# Altium project EASY-EAI-Nano-TB V1.01.PrjPcb (part 4 of 4)

## Sheet 18.ADB.SchDoc
size A4; CheckedBy: YPC; DocumentNumber: 18; Revision: V1.00; SheetNumber: 18; SheetTotal: 18; SheetName: ADB; SheetDescribe: SheetDescribe; Designer: JOW; DesignDate: 2025-04-25; CheckedData: 2025-04-25; Rule: PcbType=ProtelPcb
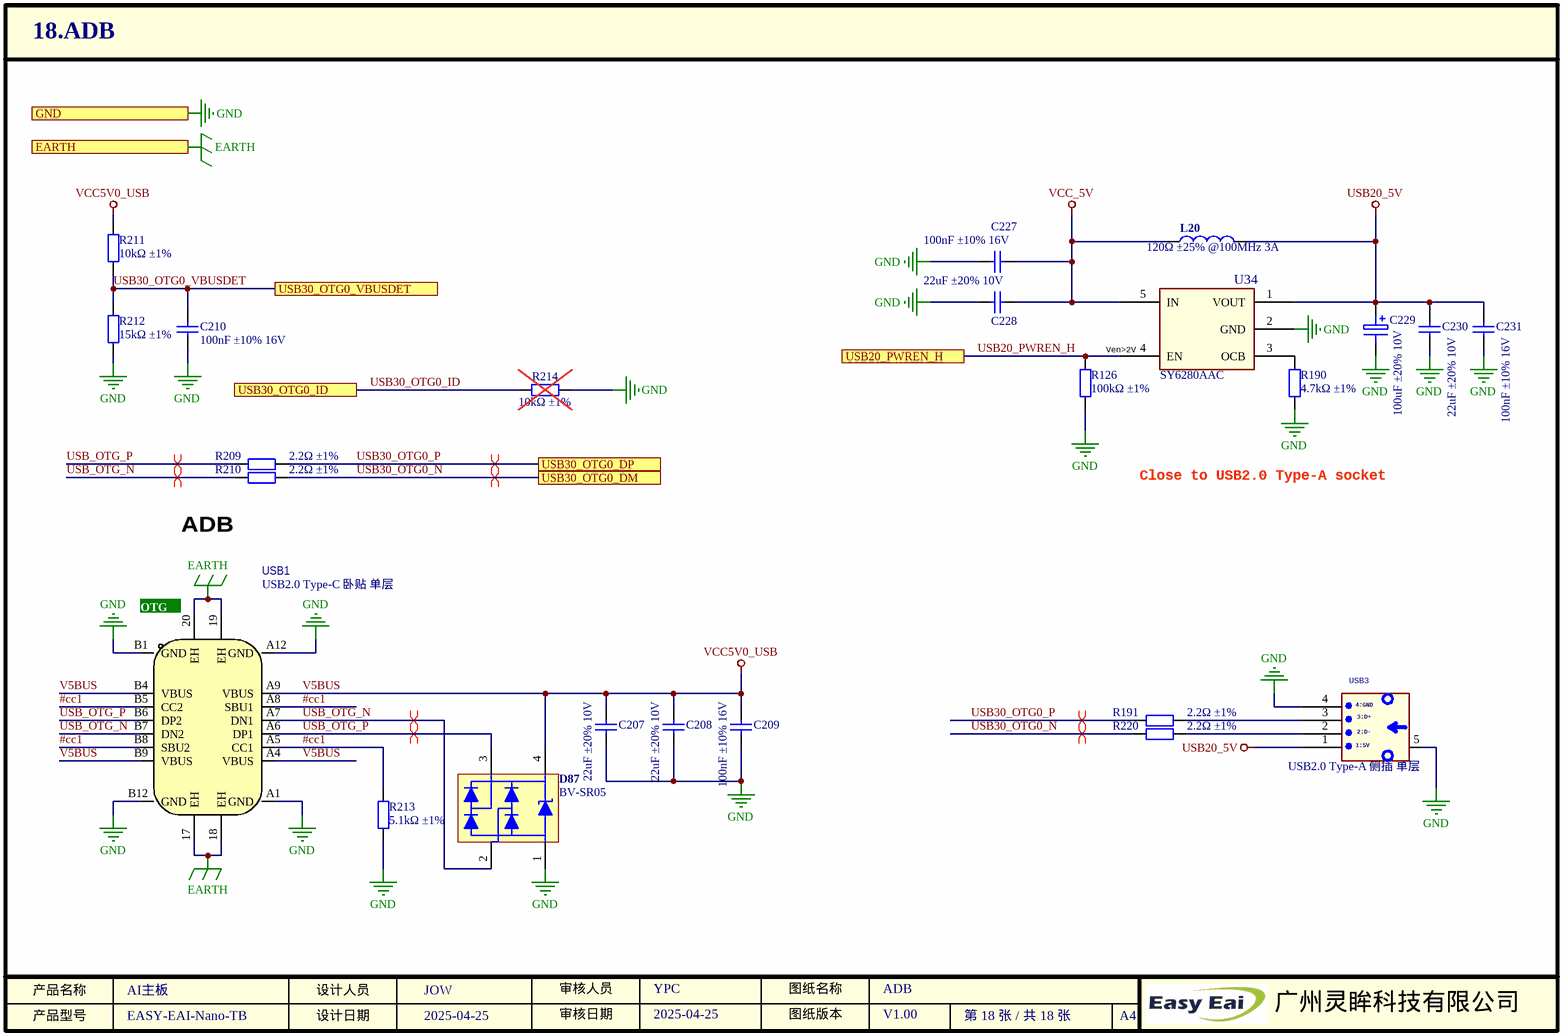
[diagram p16: 18.ADB.SchDoc]

### Parts
C207  描述: 22uF ±20% 10V  [0603_C]  (hidden comment: CL10A226MP8NUNE)
C208  描述: 22uF ±20% 10V  [0603_C]  (hidden comment: CL10A226MP8NUNE)
C209  描述: 100nF ±10% 16V  [0402_C]  (hidden comment: CL05B104KO5NNNC)
C210  描述: 100nF ±10% 16V  [0402_C]  (hidden comment: CL05B104KO5NNNC)
C227  描述: 100nF ±10% 16V  [0402_C]  (hidden comment: CL05B104KO5NNNC)
C228  描述: 22uF ±20% 10V  [0603_C]  (hidden comment: CL10A226MP8NUNE)
C229  描述: 100uF ±20% 10V  [SMD,D5xL5.4mm]  (hidden comment: RVT1A101M0505)
C230  描述: 22uF ±20% 10V  [0603_C]  (hidden comment: CL10A226MP8NUNE)
C231  描述: 100nF ±10% 16V  [0402_C]  (hidden comment: CL05B104KO5NNNC)
D87  BV-SR05  [SOT-143]
L20  BLM18KG121TN1D  [0603_R]  (value not drawn)  (no BOM)
R126  描述: 100kΩ ±1%  [0402_R]  (hidden comment: 0402WGF1003TCE)
R190  描述: 4.7kΩ ±1%  [0402_R]  (hidden comment: 0402WGF4701TCE)
R191  描述: 2.2Ω ±1%  [0402_R]  (hidden comment: 0402WGF220KTCE)
R209  描述: 2.2Ω ±1%  [0402_R]  (hidden comment: 0402WGF220KTCE)
R210  描述: 2.2Ω ±1%  [0402_R]  (hidden comment: 0402WGF220KTCE)
R211  描述: 10kΩ ±1%  [0402_R]  (hidden comment: 0402WGF1002TCE)
R212  描述: 15kΩ ±1%  [0402_R]  (hidden comment: 0402WGF1502TCE)
R213  描述: 5.1kΩ ±1%  [0402_R]  (hidden comment: 0402WGF5101TCE)
R214  描述: 10kΩ ±1%  [0402_R]  (hidden comment: NC/0402WGF1002TCE)  (no BOM)
R220  描述: 2.2Ω ±1%  [0402_R]  (hidden comment: 0402WGF220KTCE)
U34  SY6280AAC  [SOT-23-5]
USB1  USB2.0 Type-C 卧贴 单层  [USB-TYPE-C_16PIN-MALE-TYPE-C-31-M-12]
USB3  U221-041N-1BU07-S1  [MINI-USB-SMD_U221-041N-1BU07-S1]  (value not drawn)

### Ports
EARTH, GND, USB20_PWREN_H, USB30_OTG0_DM, USB30_OTG0_DP, USB30_OTG0_ID, USB30_OTG0_VBUSDET

### Nets
EARTH: USB1.17(EH) USB1.18(EH) USB1.19(EH) USB1.20(EH) ; port EARTH
GND: C207.1 C208.1 C209.1 C210.1 C227.1 C228.2 C229.2 C230.1 C231.1 D87.1 R126.1 R190.1 R212.1 R213.1 R214.1 U34.2(GND) USB1.A1(GND) USB1.A12(GND) USB1.B1(GND) USB1.B12(GND) USB3.4 USB3.5 ; port GND  [project net CHIP_GND]
USB20_5V: C229.1 C230.2 C231.2 L20.2 U34.1(VOUT) USB3.1
V5BUS: C207.2 C208.2 C209.2 D87.4 R211.2 USB1.A4(VBUS) USB1.A9(VBUS) USB1.B4(VBUS) USB1.B9(VBUS)  [also labelled VCC5V0_USB]
VCC_5V: C227.2 C228.1 L20.1 U34.5(IN)
#cc1: R213.2 USB1.A5(CC1) USB1.A8(SBU1) USB1.B5(CC2) USB1.B8(SBU2)
USB20_PWREN_H: R126.2 U34.4(EN) ; port USB20_PWREN_H
USB30_OTG0_ID: R214.2 ; port USB30_OTG0_ID
USB30_OTG0_N: R210.2 R220.1 ; port USB30_OTG0_DM
USB30_OTG0_P: R191.1 R209.2 ; port USB30_OTG0_DP
USB30_OTG0_VBUSDET: C210.2 R211.1 R212.2 ; port USB30_OTG0_VBUSDET
USB_OTG_N: D87.2 R210.1 USB1.A7(DN1) USB1.B7(DN2)
USB_OTG_P: D87.3 R209.1 USB1.A6(DP1) USB1.B6(DP2)
NetR190_2: R190.2 U34.3(OCB)
NetR191_2: R191.2 USB3.3
NetR220_2: R220.2 USB3.2

### Layout directives
differential pair: USB30_OTG0_N, USB30_OTG0_P, USB_OTG_N, USB_OTG_P

### Notes on the sheet
- Ven>2V
- Close to USB2.0 Type-A socket
- ADB
- (near USB1) OTG
- 产品名称
- 产品型号
- 设计人员
- 设计日期
- 审核人员
- 审核日期
- 图纸版本
- 图纸名称
- A4
- 广州灵眸科技有限公司
- (in symbol USB2.0 Type-A 侧插 单层) 4:GND; 3:D+; 2:D-; 1:5V

### Library data of the parts
C207 C208 C228 C230 = 0603 22uF ±20% 10V: SPZL000315; 名称: 贴片电容; 厂商: SAMSUNG(三星); 封装: 0603; 工作温度: -55~85℃; 贴片和直插: SMD; 型号: CL10A226MP8NUNE; SuppliersPartNumber: C86295; 商品编号: SPZL000315
C209 C210 C227 C231 = 0402 100nF ±10% 16V: as C193-C198 on sheet 08.USB3.0-RGMII; 型号: CL05B104KO5NNNC; SuppliersPartNumber: C1525; 商品编号: SPZL000259
C229 = 电解电容 100uF ±20% 10V: SPZL000265; 名称: 电解电容; 厂商: ROQANG(容强); 贴片和直插: SMD; 工作温度: -55~105℃; SuppliersPartNumber: C72473; 封装: SMD,D5xL5.4mm; 型号: RVT1A101M0505; 商品编号: SPZL000265
D87 = TVS BV-SR05: SPZL000616; 名称: TVS; 厂商: Bencent(槟城); 贴片和直插: SMD; 描述: Vdrm=5V Cj=0.85pF; 工作温度: -40~125℃; 封装: SOT-143; SuppliersPartNumber: C413946; 商品编号: SPZL000616; 型号: BV-SR05
L20 = 120Ω ±25% @100MHz 3A: SPZL000842; 名称: 磁珠; 封装: 0603; 厂商: muRata(村田); 贴片和直插: SMD; 工作温度: -40~85℃; SuppliersPartNumber: C85831; 型号: BLM18KG121TN1D; 商品编号: SPZL000842; 描述: 120Ω ±25% @100MHz 3A
R126 = 0402 100kΩ ±1%: SPZL000282; 封装: 0402; 厂商: UNI-ROYAL(厚声); 贴片和直插: SMD; 名称: 电阻; 工作温度: -55~155℃; SuppliersPartNumber: C25741; 型号: 0402WGF1003TCE; 商品编号: SPZL000282
R190 = 0402 4.7kΩ ±1%: SPZL000280; 封装: 0402; 厂商: UNI-ROYAL(厚声); 贴片和直插: SMD; 名称: 电阻; 工作温度: -55~155℃; SuppliersPartNumber: C25900; 型号: 0402WGF4701TCE; 商品编号: SPZL000280
R191 R209 R210 R220 = 0402 2.2Ω ±1%: SPZL000327; 封装: 0402; 厂商: UNI-ROYAL(厚声); 贴片和直插: SMD; 名称: 电阻; 工作温度: -55~155℃; SuppliersPartNumber: C25101; 型号: 0402WGF220KTCE; 商品编号: SPZL000327
R211 R214 = 0402 10kΩ ±1%: SPZL000271; 封装: 0402; 厂商: UNI-ROYAL(厚声); 贴片和直插: SMD; 名称: 电阻; 工作温度: -55~155℃; SuppliersPartNumber: C25744; 型号: 0402WGF1002TCE; 商品编号: SPZL000271
R212 = 0402 15kΩ ±1%: SPZL000330; 封装: 0402; 厂商: UNI-ROYAL(厚声); 贴片和直插: SMD; 名称: 电阻; 工作温度: -55~155℃; SuppliersPartNumber: C25756; 型号: 0402WGF1502TCE; 商品编号: SPZL000330
R213 = 0402 5.1kΩ ±1%: SPZL000270; 封装: 0402; 厂商: UNI-ROYAL(厚声); 贴片和直插: SMD; 名称: 电阻; 工作温度: -55~155℃; SuppliersPartNumber: C25905; 型号: 0402WGF5101TCE; 商品编号: SPZL000270
U34 = SY6280AAC: SPZL000043; 贴片和直插: SMD; 厂商: silergy(矽力杰); 名称: 电源IC; 描述: 功率电子开关; 工作温度: -40~85℃; SuppliersPartNumber: C55136; 封装: SOT-23-5; 商品编号: SPZL000043; 型号: SY6280AAC
USB1 = USB2.0 Type-C 卧贴 单层: SPZL000132; 厂商: 韩国韩荣; 名称: USB连接器; 封装: SMD; 型号: TYPE-C-31-M-12; 贴片和直插: SMD; 商品编号: SPZL000132; SuppliersPartNumber: C165948; 描述: USB2.0 Type-C 卧贴 单层
USB3 = USB2.0 Type-A 侧插 单层: SPZL001070; 厂商: XKB Connection(中国星坤); 封装: 插件; 名称: USB连接器; 贴片和直插: THT; 工作温度: -45~85℃; 型号: U221-041N-1BU07-S1; 商品编号: SPZL001070; SuppliersPartNumber: C2682184; 描述: USB2.0 Type-A 侧插 单层

## Sheet 12.MiniPcie-4G.SchDoc
size A4; CheckedBy: YPC; DocumentNumber: 12; Revision: V1.00; SheetNumber: 12; SheetTotal: 18; SheetName: MiniPcie-4G; SheetDescribe: MiniPcie-4G/USB2.0; Designer: JOW; DesignDate: 2025-04-25; CheckedData: 2025-04-25; Rule: PcbType=ProtelPcb
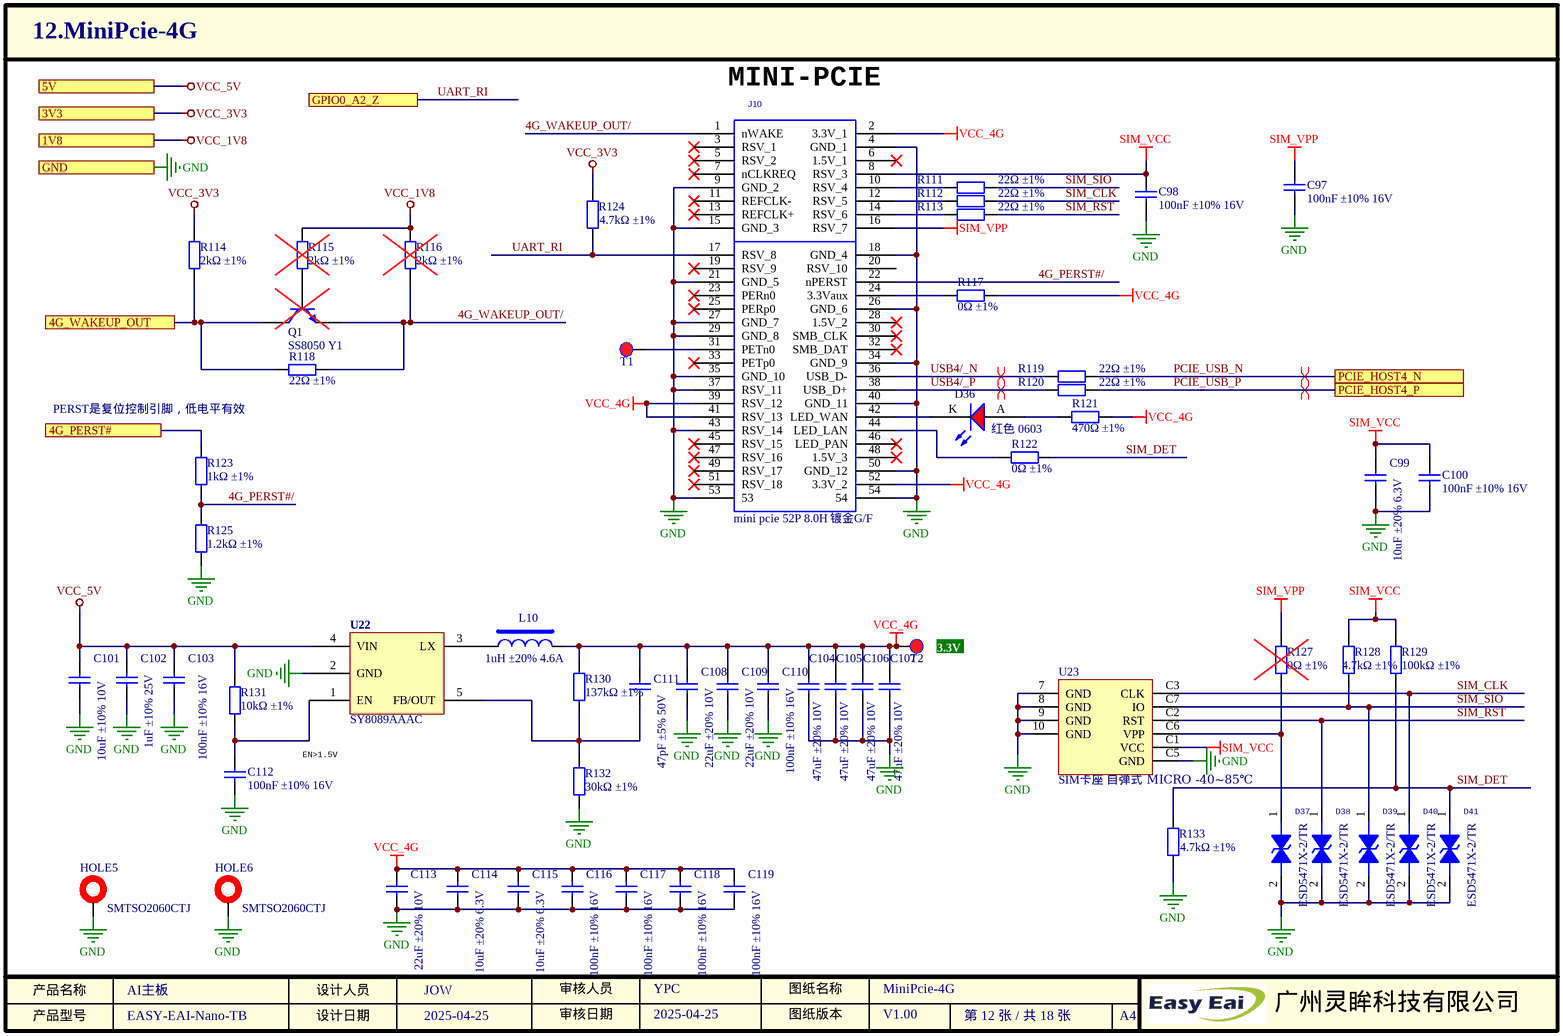
[diagram p17: 12.MiniPcie-4G.SchDoc]

### Parts
C97  描述: 100nF ±10% 16V  [0402_C]  (hidden comment: CL05B104KO5NNNC)
C98  描述: 100nF ±10% 16V  [0402_C]  (hidden comment: CL05B104KO5NNNC)
C99  描述: 10uF ±20% 6.3V  [0402_C]  (hidden comment: CL05A106MQ5NUNC)
C100  描述: 100nF ±10% 16V  [0402_C]  (hidden comment: CL05B104KO5NNNC)
C101  描述: 10uF ±10% 10V  [0603_C]  (hidden comment: CL10A106KP8NNNC)
C102  描述: 1uF ±10% 25V  [0402_C]  (hidden comment: CL05A105KA5NQNC)
C103  描述: 100nF ±10% 16V  [0402_C]  (hidden comment: CL05B104KO5NNNC)
C104  描述: 47uF ±20% 10V  [0805_C]  (hidden comment: C2012X5R1A476MTJ00E)
C105  描述: 47uF ±20% 10V  [0805_C]  (hidden comment: C2012X5R1A476MTJ00E)
C106  描述: 47uF ±20% 10V  [0805_C]  (hidden comment: C2012X5R1A476MTJ00E)
C107  描述: 47uF ±20% 10V  [0805_C]  (hidden comment: C2012X5R1A476MTJ00E)
C108  描述: 22uF ±20% 10V  [0603_C]  (hidden comment: CL10A226MP8NUNE)
C109  描述: 22uF ±20% 10V  [0603_C]  (hidden comment: CL10A226MP8NUNE)
C110  描述: 100nF ±10% 16V  [0402_C]  (hidden comment: CL05B104KO5NNNC)
C111  描述: 47pF ±5% 50V  [0402_C]  (hidden comment: NC/0402CG470J500NT)
C112  描述: 100nF ±10% 16V  [0402_C]  (hidden comment: CL05B104KO5NNNC)
C113  描述: 22uF ±20% 10V  [0603_C]  (hidden comment: CL10A226MP8NUNE)
C114  描述: 10uF ±20% 6.3V  [0402_C]  (hidden comment: CL05A106MQ5NUNC)
C115  描述: 10uF ±20% 6.3V  [0402_C]  (hidden comment: CL05A106MQ5NUNC)
C116  描述: 100nF ±10% 16V  [0402_C]  (hidden comment: CL05B104KO5NNNC)
C117  描述: 100nF ±10% 16V  [0402_C]  (hidden comment: CL05B104KO5NNNC)
C118  描述: 100nF ±10% 16V  [0402_C]  (hidden comment: CL05B104KO5NNNC)
C119  描述: 100nF ±10% 16V  [0402_C]  (hidden comment: CL05B104KO5NNNC)
D36  红色 0603  [0603_LED_S1]
D37  ESD5471X-2/TR  [FBP-02C]
D38  ESD5471X-2/TR  [FBP-02C]
D39  ESD5471X-2/TR  [FBP-02C]
D40  ESD5471X-2/TR  [FBP-02C]
D41  ESD5471X-2/TR  [FBP-02C]
HOLE5  SMTSO2060CTJ  [Mou Hole-373D600H-SMD]
HOLE6  SMTSO2060CTJ  [Mou Hole-373D600H-SMD]
J10  91304-80-052R2  [MEDC52-32F-PCIE-LOCK-L]  (value not drawn)
L10  WPN252010U1R0MT  [1008]  (value not drawn)
Q1  型号: SS8050 Y1  [SOT-23(SOT-23-3)]  (hidden comment: NC/SS8050 Y1)  (no BOM)
R111  描述: 22Ω ±1%  [0402_R]  (hidden comment: 0402WGF220JTCE)
R112  描述: 22Ω ±1%  [0402_R]  (hidden comment: 0402WGF220JTCE)
R113  描述: 22Ω ±1%  [0402_R]  (hidden comment: 0402WGF220JTCE)
R114  描述: 2kΩ ±1%  [0402_R]  (hidden comment: 0402WGF2001TCE)
R115  描述: 2kΩ ±1%  [0402_R]  (hidden comment: NC/0402WGF2001TCE)  (no BOM)
R116  描述: 2kΩ ±1%  [0402_R]  (hidden comment: NC/0402WGF2001TCE)  (no BOM)
R117  描述: 0Ω ±1%  [0402_R]  (hidden comment: 0402WGF0000TCE)
R118  描述: 22Ω ±1%  [0402_R]  (hidden comment: 0402WGF220JTCE)
R119  描述: 22Ω ±1%  [0402_R]  (hidden comment: 0402WGF220JTCE)
R120  描述: 22Ω ±1%  [0402_R]  (hidden comment: 0402WGF220JTCE)
R121  描述: 470Ω ±1%  [0402_R]  (hidden comment: AC0402FR-07470RL)
R122  描述: 0Ω ±1%  [0402_R]  (hidden comment: 0402WGF0000TCE)
R123  描述: 1kΩ ±1%  [0402_R]  (hidden comment: 0402WGF1001TCE)
R124  描述: 4.7kΩ ±1%  [0402_R]  (hidden comment: 0402WGF4701TCE)
R125  描述: 1.2kΩ ±1%  [0402_R]  (hidden comment: AC0402FR-071K2L)
R127  描述: 0Ω ±1%  [0402_R]  (hidden comment: NC/0402WGF0000TCE)  (no BOM)
R128  描述: 4.7kΩ ±1%  [0402_R]  (hidden comment: 0402WGF4701TCE)
R129  描述: 100kΩ ±1%  [0402_R]  (hidden comment: 0402WGF1003TCE)
R130  描述: 137kΩ ±1%  [0402_R]  (hidden comment: 0402WGF1373TCE)
R131  描述: 10kΩ ±1%  [0402_R]  (hidden comment: 0402WGF1002TCE)
R132  描述: 30kΩ ±1%  [0402_R]  (hidden comment: NQ02WGF3002TCE)
R133  描述: 4.7kΩ ±1%  [0402_R]  (hidden comment: 0402WGF4701TCE)
T1  TEST-DOT  [PAD-25/40]  (value not drawn)
T2  TEST-DOT  [PAD-25/40]  (value not drawn)
U22  SY8089AAAC  [SOT-23-5]
U23  描述: SIM卡座 自弹式 MICRO -40~85℃  [SIM-SMD_SMC-202-6]  (hidden comment: SMC-202-6)

### Ports
1V8, 3V3, 4G_PERST#, 4G_WAKEUP_OUT, 5V, GND, GPIO0_A2_Z, PCIE_HOST4_N, PCIE_HOST4_P

### Nets
GND: C97.1 C98.1 C99.1 C100.1 C101.1 C102.1 C103.1 C104.1 C105.1 C106.1 C107.1 C108.1 C109.1 C110.1 C112.1 C113.1 C114.1 C115.1 C116.1 C117.1 C118.1 C119.1 D37.2 D38.2 D39.2 D40.2 D41.2 HOLE5.1 HOLE6.1 J10.4(GND_1) J10.9(GND_2) J10.15(GND_3) J10.18(GND_4) J10.21(GND_5) J10.26(GND_6) J10.27(GND_7) J10.29(GND_8) J10.34(GND_9) J10.35(GND_10) J10.37(RSV_11) J10.40(GND_11) J10.43(RSV_14) J10.50(GND_12) J10.53 J10.54 R125.1 R132.1 R133.1 U22.2(GND) U23.7(GND) U23.8(GND) U23.9(GND) U23.10(GND) U23.C5(GND) ; port GND  [project net CHIP_GND]
SIM_VCC: C98.2 C99.2 C100.2 J10.8(RSV_3) R128.2 R129.2 U23.C1(VCC)
SIM_VPP: C97.2 J10.16(RSV_7) R127.2
VCC_1V8: R115.2 R116.2 ; port 1V8
VCC_3V3: R114.2 R124.2 ; port 3V3  [project net VCC3V3]
VCC_4G: C104.2 C105.2 C106.2 C107.2 C108.2 C109.2 C110.2 C111.2 C113.2 C114.2 C115.2 C116.2 C117.2 C118.2 C119.2 J10.2(3.3V_1) J10.39(RSV_12) J10.41(RSV_13) J10.52(3.3V_2) L10.2 R117.2 R121.2 R130.2 T2.1
VCC_5V: C101.2 C102.2 C103.2 R131.2 U22.4(VIN) ; port 5V
4G_PERST#/: J10.22(nPERST) R123.1 R125.2
4G_WAKEUP_OUT/: J10.1(nWAKE) Q1.2(E) R116.1 R118.2
PCIE_USB_N: R119.2 ; port PCIE_HOST4_N
PCIE_USB_P: R120.2 ; port PCIE_HOST4_P
SIM_CLK: D40.1 R112.2 U23.C3(CLK)
SIM_DET: D41.1 R122.2 R129.1 R133.2
SIM_RST: D38.1 R113.2 U23.C2(RST)
SIM_SIO: D39.1 R111.2 R128.1 U23.C7(IO)
UART_RI: J10.17(RSV_8) R124.1 ; port GPIO0_A2_Z
USB4/_N: J10.36(USB_D-) R119.1
USB4/_P: J10.38(USB_D+) R120.1
NetC111_1: C111.1 R130.1 R132.2 U22.5(FB/OUT)
NetC112_2: C112.2 R131.1 U22.1(EN)
NetD36_A: D36.A R121.1
NetD36_K: D36.K J10.42(LED_WAN)
NetD37_1: D37.1 R127.1 U23.C6(VPP)
NetJ10_10: J10.10(RSV_4) R111.1
NetJ10_12: J10.12(RSV_5) R112.1
NetJ10_14: J10.14(RSV_6) R113.1
NetJ10_24: J10.24(3.3Vaux) R117.1
NetJ10_31: J10.31(PETn0) T1.1
NetJ10_44: J10.44(LED_LAN) R122.1
NetL10_1: L10.1 U22.3(LX)
NetQ1_1: Q1.1(B) R115.1
NetQ1_3: Q1.3(C) R114.1 R118.1 ; port 4G_WAKEUP_OUT
NetR123_2: R123.2 ; port 4G_PERST#

Not connected (* = marked no-connect by the designer): J10 3(RSV_1)* 5(RSV_2)* 6(1.5V_1)* 7(nCLKREQ)* 11(REFCLK-)* 13(REFCLK+)* 19(RSV_9)* 20(RSV_10) 23(PERn0)* 25(PERp0)* 28(1.5V_2)* 30(SMB_CLK)* 32(SMB_DAT)* 33(PETp0)* 45(RSV_15)* 46(LED_PAN)* 47(RSV_16)* 48(1.5V_3)* 49(RSV_17)* 51(RSV_18)*

### Layout directives
differential pair: PCIE_USB_N, PCIE_USB_P, USB4/_N, USB4/_P

### Notes on the sheet
- (near J10) MINI-PCIE
- PERST是复位控制引脚，低电平有效
- (near T2) 3.3V
- EN>1.5V
- 产品名称
- 产品型号
- 设计人员
- 设计日期
- 审核人员
- 审核日期
- 图纸版本
- 图纸名称
- A4
- 广州灵眸科技有限公司

### Library data of the parts
C97 C98 C100 C103 C110 C112 C116-C119 = 0402 100nF ±10% 16V: as C193-C198 on sheet 08.USB3.0-RGMII; 型号: CL05B104KO5NNNC; SuppliersPartNumber: C1525; 商品编号: SPZL000259
C99 C114 C115 = 0402 10uF ±20% 6.3V: SPZL000269; 名称: 贴片电容; 厂商: SAMSUNG(三星); 封装: 0402; 工作温度: -55~85℃; 贴片和直插: SMD; 型号: CL05A106MQ5NUNC; SuppliersPartNumber: C15525; 商品编号: SPZL000269
C101 = 0603 10uF ±10% 10V: SPZL000260; 名称: 贴片电容; 厂商: SAMSUNG(三星); 封装: 0603; 工作温度: -55~85℃; 贴片和直插: SMD; 型号: CL10A106KP8NNNC; SuppliersPartNumber: C19702; 商品编号: SPZL000260
C102 = 0402 1uF ±10% 25V: SPZL000337; 名称: 贴片电容; 厂商: SAMSUNG(三星); 封装: 0402; 工作温度: -55~85℃; 贴片和直插: SMD; 型号: CL05A105KA5NQNC; SuppliersPartNumber: C52923; 商品编号: SPZL000337
C104-C107 = 0805 47uF ±20% 10V: SPZL001333; 名称: 贴片电容; 厂商: TDK; 封装: 0805; 工作温度: -55~85℃; 贴片和直插: SMD; 型号: C2012X5R1A476MTJ00E; SuppliersPartNumber: C76636; 商品编号: SPZL001333
C108 C109 C113 = 0603 22uF ±20% 10V: as C207 on sheet 18.ADB; 型号: CL10A226MP8NUNE; SuppliersPartNumber: C86295; 商品编号: SPZL000315
C111 = 0402 47pF ±5% 50V: SPZL000882; 名称: 贴片电容; 厂商: FH(风华); 封装: 0402; 工作温度: -55~125℃; 贴片和直插: SMD; 型号: 0402CG470J500NT; SuppliersPartNumber: C1567; 商品编号: SPZL000882
D36 = 红色 0603: SPZL000214; 厂商: EVERLIGHT(台湾亿光); 封装: 0603; 贴片和直插: SMD; 型号: 19-217/R6C-AL1M2VY/3T; 名称: LED; 工作温度: -40~85℃; SuppliersPartNumber: C72044; 商品编号: SPZL000214; 描述: 红色 0603
D37-D41 = TVS ESD5471X-2/TR: SPZL000254; 名称: TVS; 贴片和直插: SMD; 厂商: WillSemi(韦尔半导体); 描述: Vdrm=5V Cj=9pF; 工作温度: -40~85℃; SuppliersPartNumber: C239631; 封装: FBP-02C; 商品编号: SPZL000254; 型号: ESD5471X-2/TR
HOLE5 HOLE6 = 螺柱 SMTSO-M2-6ET: SPZL000166; 名称: 螺柱; 封装: SMD; 厂商: 雄和远景; 描述: 螺丝孔径2mm 高6mm; 贴片和直插: SMD; SuppliersPartNumber: *; 工作温度: *; 型号: SMTSO2060CTJ; 商品编号: SPZL000166
J10 = mini pcie 52P 8.0H 镀金G/F: SPZL000136; 名称: MiniPCIe座子; 封装: SMD; 厂商: UMaxconn; 贴片和直插: SMD; SuppliersPartNumber: C404124; 型号: 91304-80-052R2; 商品编号: SPZL000136; 工作温度: *; 描述: mini pcie 52P 8.0H 镀金G/F
L10 = 1uH ±20% 4.6A: SPZL000872; 名称: 电感; 厂商: Sunlord(顺络); 贴片和直插: SMD; 工作温度: -40~125℃; 封装: 1008; 型号: WPN252010U1R0MT; SuppliersPartNumber: C279952; 商品编号: SPZL000872; 描述: 1uH ±20% 4.6A
Q1 = NPN SS8050 Y1: 封装: SOT-23; 厂商: CJ（江苏长电/长晶）; 名称: 三极管; 贴片和直插: SMD; 描述: NPN 25V 1.5A; 工作温度: -55~150℃; SuppliersPartNumber: C2150
R111-R113 R118-R120 = 0402 22Ω ±1%: SPZL000279; 封装: 0402; 厂商: UNI-ROYAL(厚声); 贴片和直插: SMD; 名称: 电阻; 工作温度: -55~155℃; SuppliersPartNumber: C25092; 型号: 0402WGF220JTCE; 商品编号: SPZL000279
R114 = 0402 2kΩ ±1%: SPZL000278; 封装: 0402; 厂商: UNI-ROYAL(厚声); 贴片和直插: SMD; 名称: 电阻; 工作温度: -55~155℃; SuppliersPartNumber: C4109; 型号: 0402WGF2001TCE; 商品编号: SPZL000278
R115 R116 = 0402 2kΩ ±1%: 封装: 0402; 厂商: UNI-ROYAL(厚声); 贴片和直插: SMD; 名称: 电阻; 工作温度: -55~155℃; SuppliersPartNumber: C4109; 型号: 0402WGF2001TCE
R117 R122 = 0402 0Ω ±1%: SPZL000276; 封装: 0402; 厂商: UNI-ROYAL(厚声); 贴片和直插: SMD; 名称: 电阻; 工作温度: -55~125℃; SuppliersPartNumber: C17168; 型号: 0402WGF0000TCE; 商品编号: SPZL000276
R121 = 0402 470Ω ±1%: SPZL000329; 封装: 0402; 厂商: YAGEO(国巨); 贴片和直插: SMD; 名称: 电阻; 工作温度: -55~155℃; SuppliersPartNumber: C227095; 型号: AC0402FR-07470RL; 商品编号: SPZL000329
R123 = 0402 1kΩ ±1%: SPZL000275; 封装: 0402; 厂商: UNI-ROYAL(厚声); 贴片和直插: SMD; 名称: 电阻; 工作温度: -55~125℃; SuppliersPartNumber: C11702; 型号: 0402WGF1001TCE; 商品编号: SPZL000275
R124 R128 R133 = 0402 4.7kΩ ±1%: as R190 on sheet 18.ADB; SuppliersPartNumber: C25900; 型号: 0402WGF4701TCE; 商品编号: SPZL000280
R125 = 0402 1.2kΩ ±1%: SPZL000328; 封装: 0402; 厂商: YAGEO(国巨); 贴片和直插: SMD; 名称: 电阻; 工作温度: -55~125℃; SuppliersPartNumber: C144793; 型号: AC0402FR-071K2L; 商品编号: SPZL000328
R127 = 0402 0Ω ±1%: 封装: 0402; 厂商: UNI-ROYAL(厚声); 贴片和直插: SMD; 名称: 电阻; 工作温度: -55~125℃; SuppliersPartNumber: C17168; 型号: 0402WGF0000TCE
R129 = 0402 100kΩ ±1%: as R126 on sheet 18.ADB; SuppliersPartNumber: C25741; 型号: 0402WGF1003TCE; 商品编号: SPZL000282
R130 = 0402 137kΩ ±1%: SPZL000322; 封装: 0402; 厂商: UNI-ROYAL(厚声); 贴片和直插: SMD; 名称: 电阻; 工作温度: -55~155℃; SuppliersPartNumber: C32298; 型号: 0402WGF1373TCE; 商品编号: SPZL000322
R131 = 0402 10kΩ ±1%: as R211 on sheet 18.ADB; SuppliersPartNumber: C25744; 型号: 0402WGF1002TCE; 商品编号: SPZL000271
R132 = 0402 30kΩ ±1%: SPZL000323; 封装: 0402; 厂商: UNI-ROYAL(厚声); 贴片和直插: SMD; 名称: 电阻; 工作温度: -55~155℃; SuppliersPartNumber: C965267; 型号: NQ02WGF3002TCE; 商品编号: SPZL000323
U22 = SY8089AAAC: SPZL000040; 名称: 电源IC; 厂商: silergy(矽力杰); 贴片和直插: SMD; 描述: DC-DC; 工作温度: -40~85℃; 封装: SOT-23-5; SuppliersPartNumber: C78988; 商品编号: SPZL000040; 型号: SY8089AAAC
U23 = SIM卡座 自弹式 MICRO: SPZL001068; 名称: SIM卡座; 贴片和直插: SMD; 厂商: XUNPU(讯普); 工作温度: -40~85℃; SuppliersPartNumber: C266634; 封装: SMD; 型号: SMC-202-6; 商品编号: SPZL001068

## Nets that join several sheets
CHIP_GND: 03.Main (C1.2 R1.2), 04.RV1126B_Core_Board (16 pins), 14.Power_DCIN (38 pins), 13.WDT (16 pins), 17.Other (33 pins), 05.Audio (L2.1), 06.MIPI_CSI_Camera (88 pins), 07.MIPI_DSI (29 pins), 10.TF (9 pins), 11.WIFI_L-NLODB37 (17 pins), 09.Ethernet-RGMII (43 pins), 15.Raspberry_Pi_Interface (40 pins), 08.USB3.0-RGMII (39 pins), 16.USB_HUB_GL3510 (60 pins), 18.ADB (22 pins), 12.MiniPcie-4G (54 pins)
EARTH: 03.Main (C1.1 HOLE1.1 HOLE2.1 R1.1), 17.Other (USB2.17 USB2.18 USB2.19 USB2.20), 09.Ethernet-RGMII (5 pins), 08.USB3.0-RGMII (5 pins), 16.USB_HUB_GL3510 (C190.2 J12.10 J13.10 R182.2), 18.ADB (USB1.17 USB1.18 USB1.19 USB1.20)
EARTH0: 03.Main (HOLE3.1), 14.Power_DCIN (C126.2 R140.2)
VCC3V3: 14.Power_DCIN (6 pins), 05.Audio (R5.2), 06.MIPI_CSI_Camera (12 pins), 07.MIPI_DSI (9 pins), 11.WIFI_L-NLODB37 (10 pins), 09.Ethernet-RGMII (R77.1 R82.1), 15.Raspberry_Pi_Interface (6 pins), 08.USB3.0-RGMII (R39.1), 16.USB_HUB_GL3510 (R158.1 R160.1), 12.MiniPcie-4G (R114.2 R124.2)
VCC5V_SYS: 14.Power_DCIN (14 pins), 13.WDT (C58.2 C60.2 R38.1 U18.1)
VCC_1V8: 14.Power_DCIN (C132.2 T3.1 U26.5), 05.Audio (R9.1), 06.MIPI_CSI_Camera (6 pins), 12.MiniPcie-4G (R115.2 R116.2)
VCC_5V: 14.Power_DCIN (8 pins), 05.Audio (L1.1), 07.MIPI_DSI (5 pins), 15.Raspberry_Pi_Interface (D44.2 D46.2 P1.2 P1.4), 16.USB_HUB_GL3510 (7 pins), 18.ADB (C227.2 C228.1 L20.1 U34.5), 12.MiniPcie-4G (5 pins)
CAN0_RXD_M1: 04.RV1126B_Core_Board (J15.77), 15.Raspberry_Pi_Interface (D57.2 P1.16)
CAN0_TXD_M1: 04.RV1126B_Core_Board (J15.79), 15.Raspberry_Pi_Interface (D58.2 P1.18)
DSM_AUD_RN: 04.RV1126B_Core_Board (J14.39), 05.Audio (R6.1)
DSM_AUD_RP: 04.RV1126B_Core_Board (J14.41), 05.Audio (R3.1)
GPIO5_C0_D: 04.RV1126B_Core_Board (J15.10), 15.Raspberry_Pi_Interface (D55.2 P1.13)
GPIO5_C1_D: 04.RV1126B_Core_Board (J15.12), 15.Raspberry_Pi_Interface (D56.2 P1.15)
GPIO5_C2_D: 04.RV1126B_Core_Board (J15.14), 15.Raspberry_Pi_Interface (D73.2 P1.37)
HUB_D3_N: 08.USB3.0-RGMII (U43.17), 16.USB_HUB_GL3510 (U33.7)
HUB_D3_P: 08.USB3.0-RGMII (U43.18), 16.USB_HUB_GL3510 (U33.6)
I2C5_SCL_M0: 04.RV1126B_Core_Board (J14.13), 15.Raspberry_Pi_Interface (D49.2 P1.5 R157.2)
I2C5_SDA_M0: 04.RV1126B_Core_Board (J14.11), 15.Raspberry_Pi_Interface (D48.2 P1.3 R156.2)
MIC0_N: 04.RV1126B_Core_Board (J14.43), 05.Audio (L6.1)
MIC0_P: 04.RV1126B_Core_Board (J14.45), 05.Audio (L5.1)
MIPI_DSI_TX0_CLK_N: 04.RV1126B_Core_Board (J15.64), 07.MIPI_DSI (J5.34 U17.1 U17.10)
MIPI_DSI_TX0_CLK_P: 04.RV1126B_Core_Board (J15.66), 07.MIPI_DSI (J5.35 U17.2 U17.9)
MIPI_DSI_TX0_D0_N: 04.RV1126B_Core_Board (J15.60), 07.MIPI_DSI (J5.25 U15.4 U15.7)
MIPI_DSI_TX0_D0_P: 04.RV1126B_Core_Board (J15.62), 07.MIPI_DSI (J5.26 U15.5 U15.6)
MIPI_DSI_TX0_D1_N: 04.RV1126B_Core_Board (J15.70), 07.MIPI_DSI (J5.28 U16.1 U16.10)
MIPI_DSI_TX0_D1_P: 04.RV1126B_Core_Board (J15.68), 07.MIPI_DSI (J5.29 U16.2 U16.9)
MIPI_DSI_TX0_D2_N: 04.RV1126B_Core_Board (J15.74), 07.MIPI_DSI (J5.31 U16.4 U16.7)
MIPI_DSI_TX0_D2_P: 04.RV1126B_Core_Board (J15.72), 07.MIPI_DSI (J5.32 U16.5 U16.6)
MIPI_DSI_TX0_D3_N: 04.RV1126B_Core_Board (J15.78), 07.MIPI_DSI (J5.37 U17.4 U17.7)
MIPI_DSI_TX0_D3_P: 04.RV1126B_Core_Board (J15.76), 07.MIPI_DSI (J5.38 U17.5 U17.6)
NetC206_2: 04.RV1126B_Core_Board (J14.72), 17.Other (C206.2 R208.1)
PWM1_CH0_M1: 04.RV1126B_Core_Board (J15.38), 15.Raspberry_Pi_Interface (D69.2 P1.32)
PWM1_CH1_M1: 04.RV1126B_Core_Board (J15.40), 15.Raspberry_Pi_Interface (D70.2 P1.33)
RESET: 04.RV1126B_Core_Board (J14.1), 13.WDT (C120.2 U24.1)
SAI1_LRCK_M2: 04.RV1126B_Core_Board (J15.26), 15.Raspberry_Pi_Interface (D71.2 P1.35)
SAI1_MCLK_M2: 04.RV1126B_Core_Board (J15.30), 15.Raspberry_Pi_Interface (D72.1 P1.36)
SAI1_SCLK_M2: 04.RV1126B_Core_Board (J15.28), 15.Raspberry_Pi_Interface (D54.1 P1.12)
SAI1_SDI_M2: 04.RV1126B_Core_Board (J15.24), 15.Raspberry_Pi_Interface (D74.1 P1.38)
SAI1_SDO_M2: 04.RV1126B_Core_Board (J15.32), 15.Raspberry_Pi_Interface (D75.1 P1.40)
SDMMC0_CLK: 04.RV1126B_Core_Board (J14.30), 10.TF (R95.1)
SDMMC0_CMD: 04.RV1126B_Core_Board (J14.32), 10.TF (R94.1)
SDMMC0_D0: 04.RV1126B_Core_Board (J14.34), 10.TF (R96.1)
SDMMC0_D1: 04.RV1126B_Core_Board (J14.28), 10.TF (R97.1)
SDMMC0_D2: 04.RV1126B_Core_Board (J14.26), 10.TF (R92.1)
SDMMC0_D3: 04.RV1126B_Core_Board (J14.36), 10.TF (R93.1)
SDMMC0_DET: 04.RV1126B_Core_Board (J14.24), 10.TF (R98.1 R225.1)
SPI0_CLK_M2: 04.RV1126B_Core_Board (J15.44), 15.Raspberry_Pi_Interface (D62.2 P1.23)
SPI0_CSN0_M2: 04.RV1126B_Core_Board (J15.50), 15.Raspberry_Pi_Interface (D63.1 P1.24)
SPI0_CSN1_M2: 04.RV1126B_Core_Board (J15.42), 15.Raspberry_Pi_Interface (D64.1 P1.26)
SPI0_MISO_M2: 04.RV1126B_Core_Board (J15.46), 15.Raspberry_Pi_Interface (D60.2 P1.21)
SPI0_MOSI_M2: 04.RV1126B_Core_Board (J15.48), 15.Raspberry_Pi_Interface (D59.2 P1.19)
SPI1_CLK_M1: 04.RV1126B_Core_Board (J14.23), 15.Raspberry_Pi_Interface (D68.2 P1.31)
SPI1_CS0n_M1: 04.RV1126B_Core_Board (J14.25), 15.Raspberry_Pi_Interface (D66.1 P1.28)
SPI1_CS1n_M1: 04.RV1126B_Core_Board (J14.27), 15.Raspberry_Pi_Interface (D61.1 P1.22)
SPI1_MISO_M1: 04.RV1126B_Core_Board (J14.21), 15.Raspberry_Pi_Interface (D67.2 P1.29)
SPI1_MOSI_M1: 04.RV1126B_Core_Board (J14.19), 15.Raspberry_Pi_Interface (D65.2 P1.27)
SSRX_N: 08.USB3.0-RGMII (U43.15), 16.USB_HUB_GL3510 (C163.2)
SSRX_P: 08.USB3.0-RGMII (U43.16), 16.USB_HUB_GL3510 (C162.2)
UART0_RX_DBG: 04.RV1126B_Core_Board (J15.1), 17.Other (R215.1)
UART0_TX_DBG: 04.RV1126B_Core_Board (J15.3), 17.Other (R216.1)
UART2_RX_M0: 04.RV1126B_Core_Board (J15.19), 17.Other (R222.1)
UART2_TX_M0: 04.RV1126B_Core_Board (J15.21), 17.Other (R223.1)
UART6_RX_M0: 04.RV1126B_Core_Board (J15.2), 15.Raspberry_Pi_Interface (D53.2 P1.11)
UART6_TX_M0: 04.RV1126B_Core_Board (J15.4), 15.Raspberry_Pi_Interface (D50.2 P1.7)
UART7_RX_M0: 04.RV1126B_Core_Board (J15.16), 15.Raspberry_Pi_Interface (D52.2 P1.10)
UART7_TX_M0: 04.RV1126B_Core_Board (J15.18), 15.Raspberry_Pi_Interface (D51.2 P1.8)
USB3_HOST1_SSRX_N: 08.USB3.0-RGMII (C194.1), 16.USB_HUB_GL3510 (R171.1)
USB3_HOST1_SSRX_P: 08.USB3.0-RGMII (C195.1), 16.USB_HUB_GL3510 (R169.1)
WDT_EN: 13.WDT (R135.1 U25.1), 17.Other (R207.1)
WIFI_WAKE_HOST: 04.RV1126B_Core_Board (J15.11), 11.WIFI_L-NLODB37 (R100.1)